# Altium schematic sheet SCH_TemPod.SchDoc
size A4; SheetNumber: 1; SheetTotal: 1
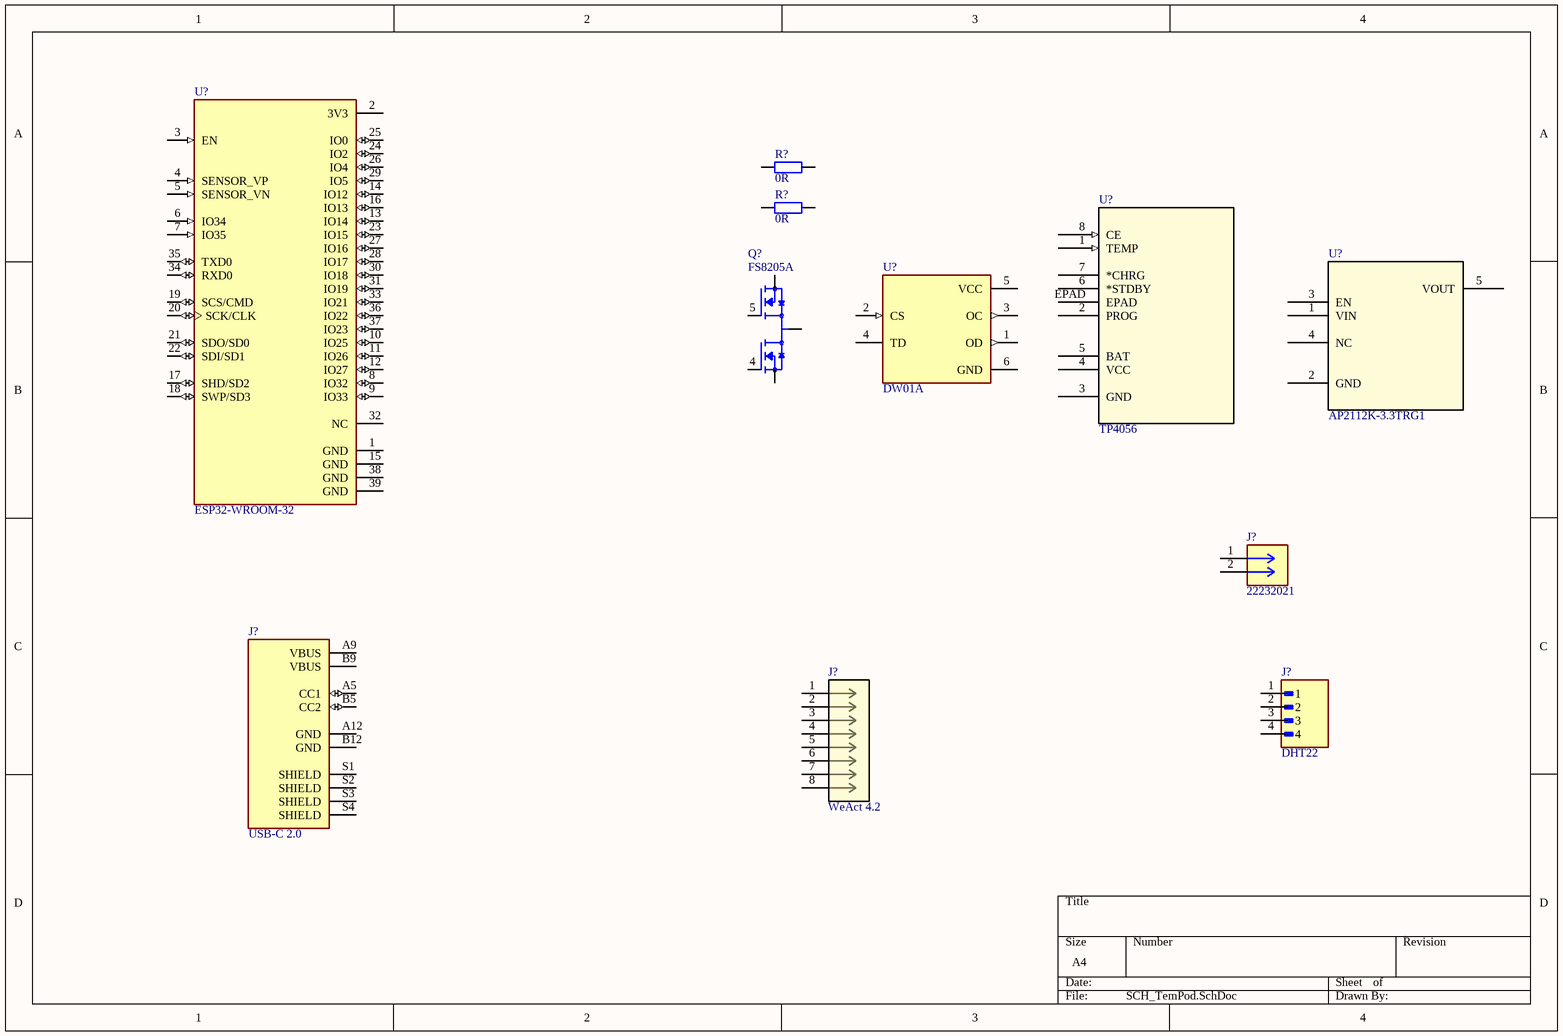
[diagram p0: SCH_TemPod.SchDoc]

## Parts
(Parts that share a designator on the sheet are numbered #1, #2 ... from top to bottom, then left to right.)
J?#1  22232021  [CONN_A-6373-02A_MOL]
J?#2  WeAct 4.2  [WeAct 4.2]
J?#3  DHT22  [DHT22]
J?#4  USB-C 2.0  [GCT_USB4125-GF-A-0190_REVA2]
Q?  FS8205A  [SOP65P640X120-8N]
R?#1  0R  [RES1206]
R?#2  0R  [RES1206]
U?#1  TP4056  [SOP8-PP_TPW]
U?#2  ESP32-WROOM-32  [MODULE_ESP32-WROOM-32]
U?#3  AP2112K-3.3TRG1  [SOT_RG1_DIO]
U?#4  DW01A  [SOT95P280X145-6N]

## Nets
NetQ?_1: Q?.1(D12) Q?.8(D12)
NetQ?_2: Q?.2(S1) Q?.3(S1)
NetQ?_6: Q?.6(S2) Q?.7(S2)

Not connected (* = marked no-connect by the designer): J?#1 1 2; J?#2 1 2 3 4 5 6 7 8; J?#3 1 2 3 4; J?#4 A5(CC1) A9(VBUS) A12(GND) B5(CC2) B9(VBUS) B12(GND) S1(SHIELD) S2(SHIELD) S3(SHIELD) S4(SHIELD); Q? 4(G1) 5(G2); R?#1 1 2; R?#2 1 2; U?#1 1(TEMP) 2(PROG) 3(GND) 4(VCC) 5(BAT) 6(*STDBY) 7(*CHRG) 8(CE) EPAD; U?#2 1(GND) 2(3V3) 3(EN) 4(SENSOR_VP) 5(SENSOR_VN) 6(IO34) 7(IO35) 8(IO32) 9(IO33) 10(IO25) 11(IO26) 12(IO27) 13(IO14) 14(IO12) 15(GND) 16(IO13) 17(SHD/SD2) 18(SWP/SD3) 19(SCS/CMD) 20(SCK/CLK) 21(SDO/SD0) 22(SDI/SD1) 23(IO15) 24(IO2) 25(IO0) 26(IO4) 27(IO16) 28(IO17) 29(IO5) 30(IO18) 31(IO19) 32(NC) 33(IO21) 34(RXD0) 35(TXD0) 36(IO22) 37(IO23) 38(GND) 39(GND); U?#3 1(VIN) 2(GND) 3(EN) 4(NC) 5(VOUT); U?#4 1(OD) 2(CS) 3(OC) 4(TD) 5(VCC) 6(GND)

## Library data of the parts
J?#1 = 22232021: Connector Header Through Hole 2 position 0.100" (2.54mm); MF: Molex; SnapEDA_Link: https://www.snapeda.com/parts/22232021/Molex/view-part/?ref=snap; Package: None; Value: *; MP: 22232021; Check_prices: https://www.snapeda.com/parts/22232021/Molex/view-part/?ref=eda; Part Number: 22232021; TempMin: -30; TempMax: 85; Datasheet Link: https://www.molex.com/en-us/products/part-detail/0022232021
J?#2 = WeAct 4.2: WeAct Studio 4.2in E-Paper Module (400x300, SPI, BWR) interface connector. No dedicated Altium part found online, so implemented as a generic 8-position vertical header matching the module's 8-pin FPC/cable interface, not the module footprint itself.; Manufacturer_Name: Molex Connector Corporation; Manufacturer_Part_Number: 10897080; Copyright: Copyright (C) 2025 Ultra Librarian. All rights reserved.; RefDes: RefDes; Type: Type; Part Number: WeAct 4.2; TempMin: -40; TempMax: 85; Datasheet Link: https://www.digikey.de/de/models/3068086
J?#3 = DHT22: Digital Temperature & Humidity Sensor, ±0.5°C / 2-5% RH, Single-Wire Digital Output, 3.3-5.5V, TO-220-4; MF: Amphenol ICC (FCI); MP: 10129378-904002BLF; SnapEDA_Link: https://www.snapeda.com/parts/10129378-904002BLF/Amphenol+FCI/view-part/?ref=snap; Package: None; Value: *; Check_prices: https://www.snapeda.com/parts/10129378-904002BLF/Amphenol+FCI/view-part/?ref=eda
J?#4 = USB4125-GF-A-0190: CONN RCPT TYPE C 6P SMD RA; MF: Global Connector Technology; SnapEDA_Link: https://www.snapeda.com/parts/USB4125-GF-A-0190/Global+Connector+Technology/view-part/?ref=snap; Package: None; Value: *; MP: USB4125-GF-A-0190; Check_prices: https://www.snapeda.com/parts/USB4125-GF-A-0190/Global+Connector+Technology/view-part/?ref=eda; Part Number: USB4125-GF-A-0190; TempMin: -30; TempMax: 85; Datasheet Link: https://gct.co/files/specs/usb4125-spec.pdf
Q? = FS8205A: Dual N-Channel Enhancement Mode Power MOSFET; MF: Fortune Semiconductor; SnapEDA_Link: https://www.snapeda.com/parts/FS8205A/Fortune+Semiconductor/view-part/?ref=snap; Package: Package; Value: *; MP: FS8205A; Check_prices: https://www.snapeda.com/parts/FS8205A/Fortune+Semiconductor/view-part/?ref=eda; Part Number: FS8205A; TempMin: -55; TempMax: 150; Datasheet Link: https://www.ic-fortune.com/upload/Download/FS8205A-DS-12_EN.pdf
R?#1 R?#2 = Resistor 1206: Part Number: Resistor 1206; TempMin: -55; TempMax: 125; Datasheet Link: -
U?#1 = TP4056: Complete Constant-Current/Constant-Voltage Linear Charger for Single Cell Li-Ion Batteries, 4.2V, up to 1A programmable via resistor, ESOP-8; Manufacturer_Name: TPOWER; Copyright: Copyright (C) 2025 Ultra Librarian. All rights reserved.; Manufacturer_Part_Number: TP4056; RefDes: RefDes; Type: Type; Part Number: TP4056; TempMin: -40; TempMax: 85; Datasheet Link: https://datasheet.lcsc.com/lcsc/1809261820_TOPPOWER-Nanjing-Extension-Microelectronics-TP4056-42-ESOP8_C16581.pdf
U?#2 = ESP32-WROOM-32: Bluetooth, WiFi 802.11b/g/n, Bluetooth v4.2 +EDR, Class 1, 2 and 3 Transceiver Module U.FL Surface Mount; MF: Espressif Systems; Price: None; Availability: In Stock; MP: ESP32-WROOM-32; Package: Module Espressif Systems; SnapEDA_Link: https://www.snapeda.com/parts/ESP32-WROOM-32/Espressif+Systems/view-part/?ref=snap; Check_prices: https://www.snapeda.com/parts/ESP32-WROOM-32/Espressif+Systems/view-part/?ref=eda; Value: *; Purchase-URL: https://pricing.snapeda.com/search/part/ESP32-WROOM-32/?ref=eda; Part Number: ESP32-WROOM-32; TempMin: -40; TempMax: 85; Datasheet Link: https://documentation.espressif.com/esp32-wroom-32_datasheet_en.pdf
U?#3 = AP2112K-3.3: 600mA CMOS LDO Regulator with Enable, 3.3V Fixed Output, 55uA Iq, SOT-23-5; Manufacturer_Name: Diodes Inc; Copyright: Copyright (C) 2026 Ultra Librarian. All rights reserved.; Manufacturer_Part_Number: AP2112K-3.3TRG1; RefDes: RefDes; Type: Type; Part Number: AP2112K-3.3; TempMin: -40; TempMax: 85; Datasheet Link: https://www.diodes.com/assets/Datasheets/AP2112.pdf
U?#4 = DW01A: One Cell Lithium-ion/Polymer Battery Protection IC; MF: Fortune Semiconductor; SnapEDA_Link: https://www.snapeda.com/parts/DW01A/Fortune+Semiconductor/view-part/?ref=snap; Package: SOT-23-6 Fortune Semiconductor; Value: *; MP: DW01A; Check_prices: https://www.snapeda.com/parts/DW01A/Fortune+Semiconductor/view-part/?ref=eda; Part Number: DW01A; TempMin: -40; TempMax: 85; Datasheet Link: https://www.snapeda.com/parts/DW01A/Fortune%20Semiconductor/datasheet/